# EAGLE schematic main (EAGLE 9.0.1)
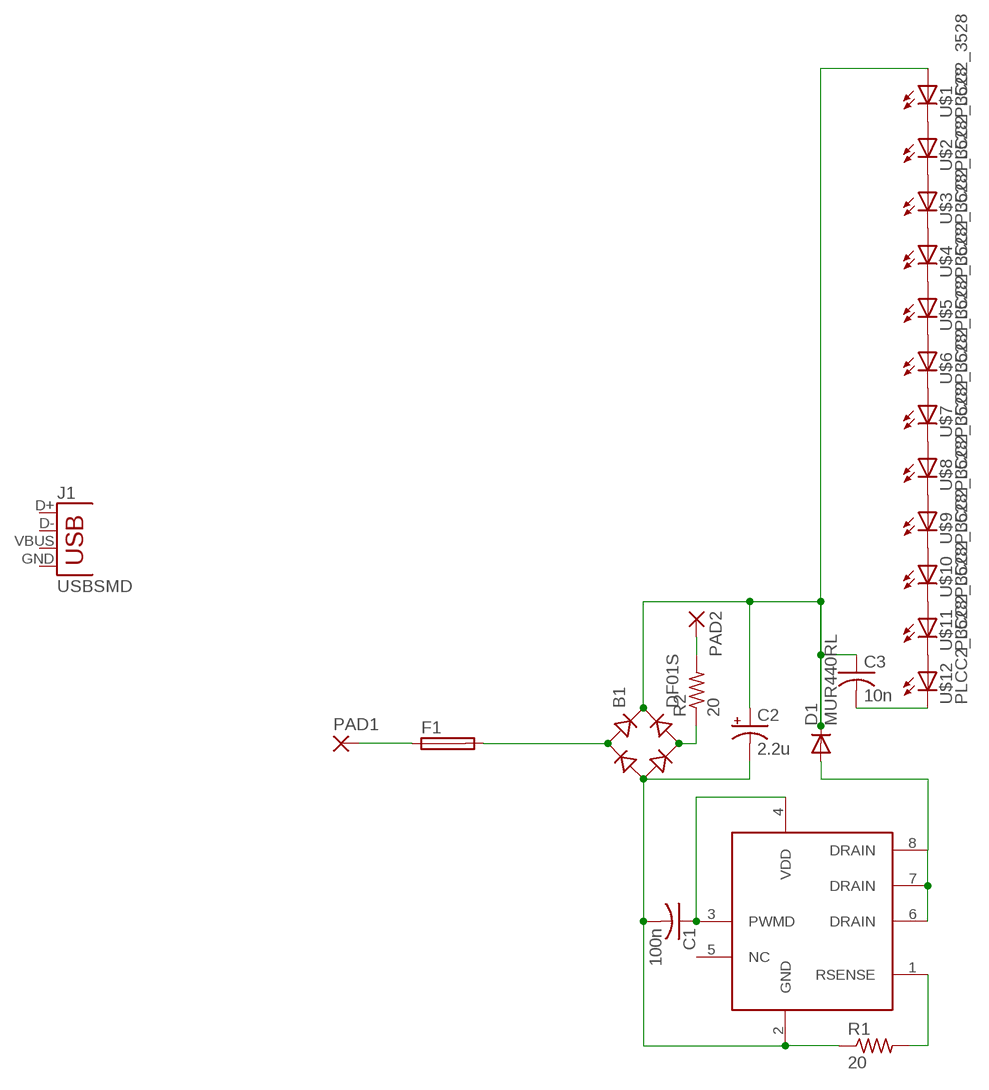
[diagram p0: schematic, sheet 1]

## Parts
B1  DF01S  [DFS]
C1  100n  C-USC0603  [C0603]
C2  2.2u  CPOL-USE3.5-8  [E3,5-8]
C3  10n  C-US025-025X050  [C025-025X050]
D1  MUR440RL  [C2673]
F1  TE5  [TE5]
J1  USBSMD  [USB-MINIB]
PAD1  2,54/1,0  [2,54/1,0]
PAD2  2,54/1,0  [2,54/1,0]
R1  20  R-US_R0805  [R0805]
R2  20  R-US_R0805  [R0805]
U$1  PLCC2_3528  [PLCC2_3528]
U$2  PLCC2_3528  [PLCC2_3528]
U$3  PLCC2_3528  [PLCC2_3528]
U$4  PLCC2_3528  [PLCC2_3528]
U$5  PLCC2_3528  [PLCC2_3528]
U$6  PLCC2_3528  [PLCC2_3528]
U$7  PLCC2_3528  [PLCC2_3528]
U$8  PLCC2_3528  [PLCC2_3528]
U$9  PLCC2_3528  [PLCC2_3528]
U$10  PLCC2_3528  [PLCC2_3528]
U$11  PLCC2_3528  [PLCC2_3528]
U$12  PLCC2_3528  [PLCC2_3528]
U$13  HV9925  [SOIC-8]

## Nets
N$1: U$1.P$2(C) U$2.P$1(A)
N$2: U$2.P$2(C) U$3.P$1(A)
N$3: U$3.P$2(C) U$4.P$1(A)
N$4: U$4.P$2(C) U$5.P$1(A)
N$5: U$5.P$2(C) U$6.P$1(A)
N$6: U$6.P$2(C) U$7.P$1(A)
N$7: U$7.P$2(C) U$8.P$1(A)
N$8: U$8.P$2(C) U$9.P$1(A)
N$9: U$9.P$2(C) U$10.P$1(A)
N$10: U$10.P$2(C) U$11.P$1(A)
N$11: U$11.P$2(C) U$12.P$1(A)
N$12: B1.AC1 F1.2
N$13: PAD2.1(P) R2.2
N$14: B1.+ C2.+ C3.1 D1.C U$1.P$1(A)
N$15: B1.- C1.2 C2.- R1.1 U$13.2(GND)
N$16: F1.1 PAD1.1(P)
N$17: D1.A U$13.6(DRAIN) U$13.7(DRAIN) U$13.8(DRAIN)
N$18: B1.AC2 R2.1
N$19: C1.1 U$13.3(PWMD) U$13.4(VDD)
N$20: R1.2 U$13.1(RSENSE)
N$21: C3.2 U$12.P$2(C)
Unconnected: J1.D+ J1.D- J1.GND J1.VBUS U$13.5(NC)

## Library data of the parts
B1 = rectifier:DF*S: Surface Mount Glass Passivated Bridge Rectifiers Source: Source: Comchip Bridge Rectifiers DF005S-G thru DF10S-G.pdf
C1 C3 = rcl:C-US: CAPACITOR, American symbol; SPICEPREFIX: C
C2 = rcl:CPOL-US: POLARIZED CAPACITOR, American symbol; SPICEPREFIX: C
D1 = diode:MUR440RL: DIODE ultra-fast recovery rectifier, Vrrm = 40 V, 4 A
F1 = fuse:TE5: FUSE Wickmann; OC_FARNELL: unknown; OC_NEWARK: unknown
J1 = SparkFun-Retired:USB: USB Connectors USB-B-PTH is fully proven SKU : PRT-00139/CONN-08278 USB-miniB is fully proven SKU : PRT-00587 USB-A-PCB is untested. USB-A-H is throughly reviewed, but untested. Spark Fun Electronics SKU : PRT-00437 USB-B-SMT is throughly reviewed, but untested. Needs silkscreen touching up. USB-A-S has not been used/tested USB-MB-H has not been used/tested USB-MICROB has been used. CONN-09505; PROD_ID: CONN-08193
PAD1 PAD2 = 7_segment_lib:2,54/1,0: THROUGH-HOLE PAD
R1 R2 = rcl:R-US_: RESISTOR, American symbol; SPICEPREFIX: R
U$1-U$12 = 7_segment_lib:PLCC2_3528
U$13 = 7_segment_lib:HV9925